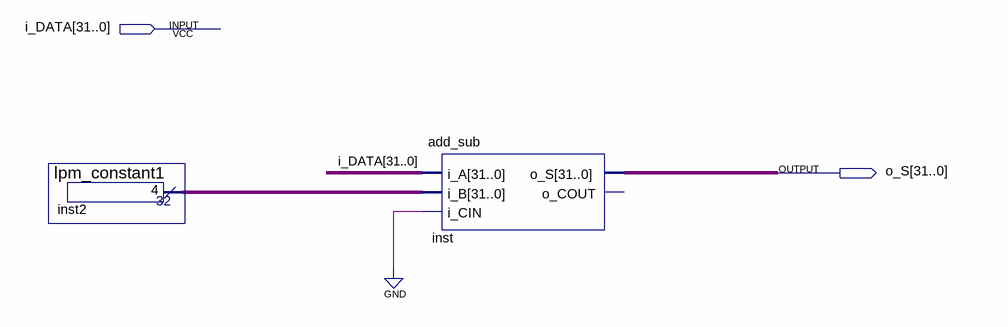
[diagram p0: schematic sheet]
// Quartus schematic calculo_PC.bdf as structural Verilog: 2 symbols, 2 pins
module calculo_PC (
  input  [31:0] i_DATA,
  output [31:0] o_S
);

  wire [31:0] inst2_result;

  lpm_constant1 inst2 (.result(inst2_result));
  add_sub inst (.i_A(i_DATA), .i_B(inst2_result), .i_CIN(1'b0), .o_S(o_S));  // open: o_COUT
endmodule
